# EAGLE design 1606_lora_module_Rev010003 (EAGLE 9.6.2)
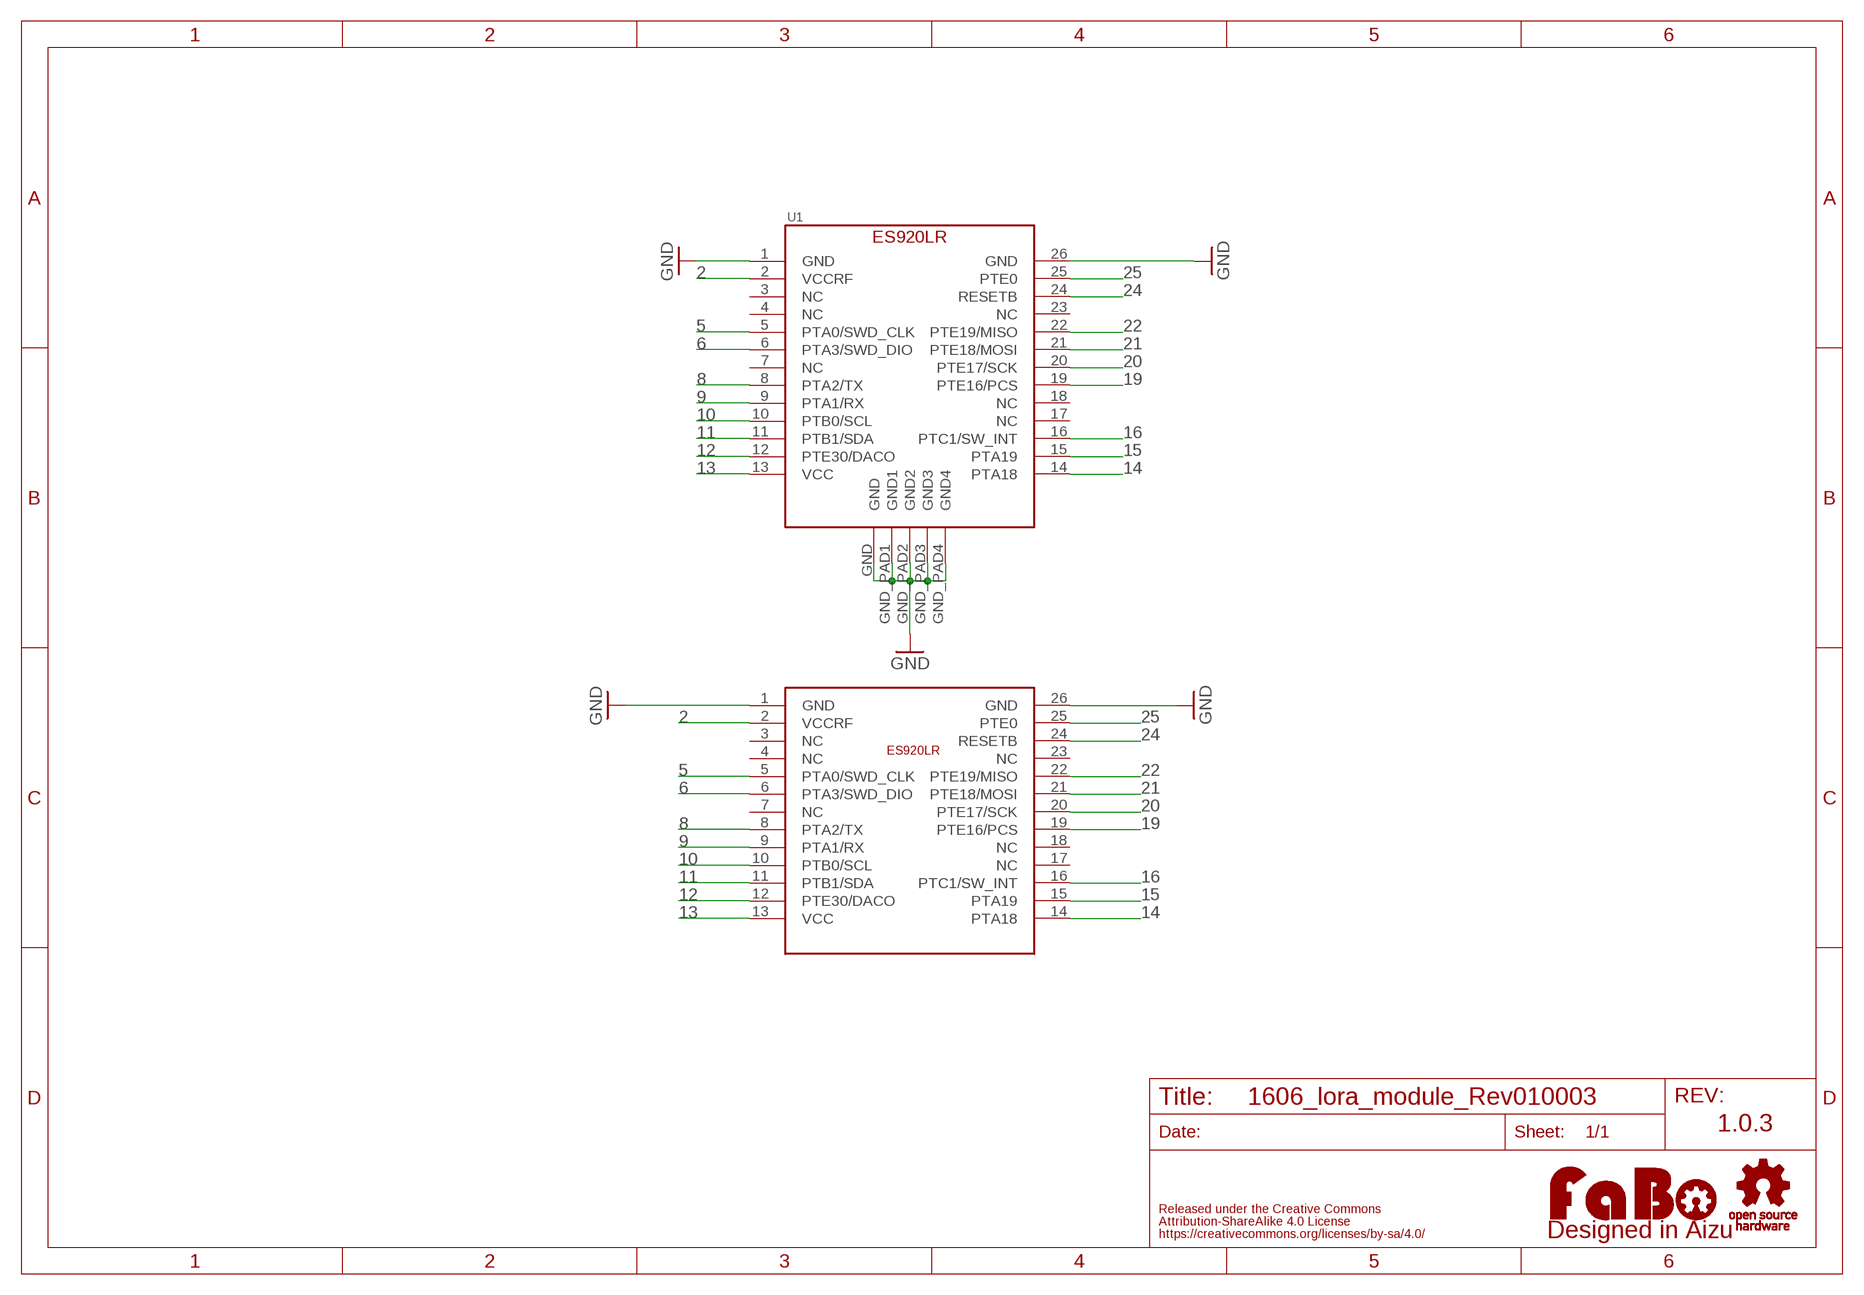
[diagram p0: schematic, sheet 1]

## Parts
U1  ES920LR  [ES920LR]
U$3  ES920LR_MODULE  [MODULE]
U$4  LOGO_OSHW-M_BOTTOM  [LOGO_OSHW_M_BOTTOM]
U$5  LOGO_FABO-M_BOTTOM  [LOGO_FABO_MS_BOTTOM]

## Nets
2: U1.2(VCCRF) U$3.2(VCCRF)
5: U1.5(PTA0/SWD_CLK) U$3.5(PTA0/SWD_CLK)
6: U1.6(PTA3/SWD_DIO) U$3.6(PTA3/SWD_DIO)
8: U1.8(PTA2/TX) U$3.8(PTA2/TX)
9: U1.9(PTA1/RX) U$3.9(PTA1/RX)
10: U1.10(PTB0/SCL) U$3.10(PTB0/SCL)
11: U1.11(PTB1/SDA) U$3.11(PTB1/SDA)
12: U1.12(PTE30/DACO) U$3.12(PTE30/DACO)
13: U1.13(VCC) U$3.13(VCC)
14: U1.14(PTA18) U$3.14(PTA18)
15: U1.15(PTA19) U$3.15(PTA19)
16: U1.16(PTC1/SW_INT) U$3.16(PTC1/SW_INT)
19: U1.19(PTE16/PCS) U$3.19(PTE16/PCS)
20: U1.20(PTE17/SCK) U$3.20(PTE17/SCK)
21: U1.21(PTE18/MOSI) U$3.21(PTE18/MOSI)
22: U1.22(PTE19/MISO) U$3.22(PTE19/MISO)
24: U1.24(RESETB) U$3.24(RESETB)
25: U1.25(PTE0) U$3.25(PTE0)
GND: U1.1(GND) U1.26(GND) U1.GND U1.GND_PAD1(GND1) U1.GND_PAD2(GND2) U1.GND_PAD3(GND3) U1.GND_PAD4(GND4) U$3.1(GND) U$3.26(GND)
Unconnected: U1.3(NC) U1.4(NC) U1.7(NC) U1.17(NC) U1.18(NC) U1.23(NC) U$3.3(NC) U$3.4(NC) U$3.7(NC) U$3.17(NC) U$3.18(NC) U$3.23(NC)

## Notes on the sheet
- 1.0.3

## Library data of the parts
U1 = FaBo-LoRa:ES920LR
U$3 = FaBo-LoRa:ES920LR_MODULE
U$4 = FaBo-Logo:LOGO_OSHW
U$5 = FaBo-Logo:LOGO_FABO

## Board
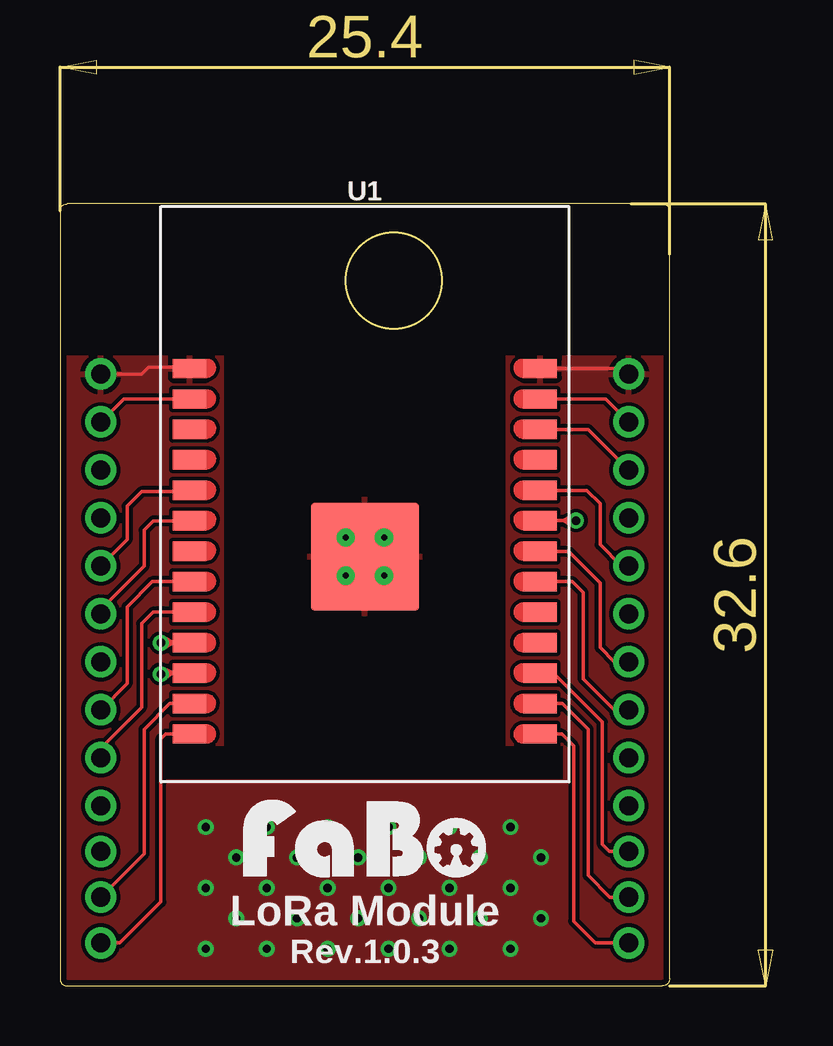
[diagram p1: board, top side]
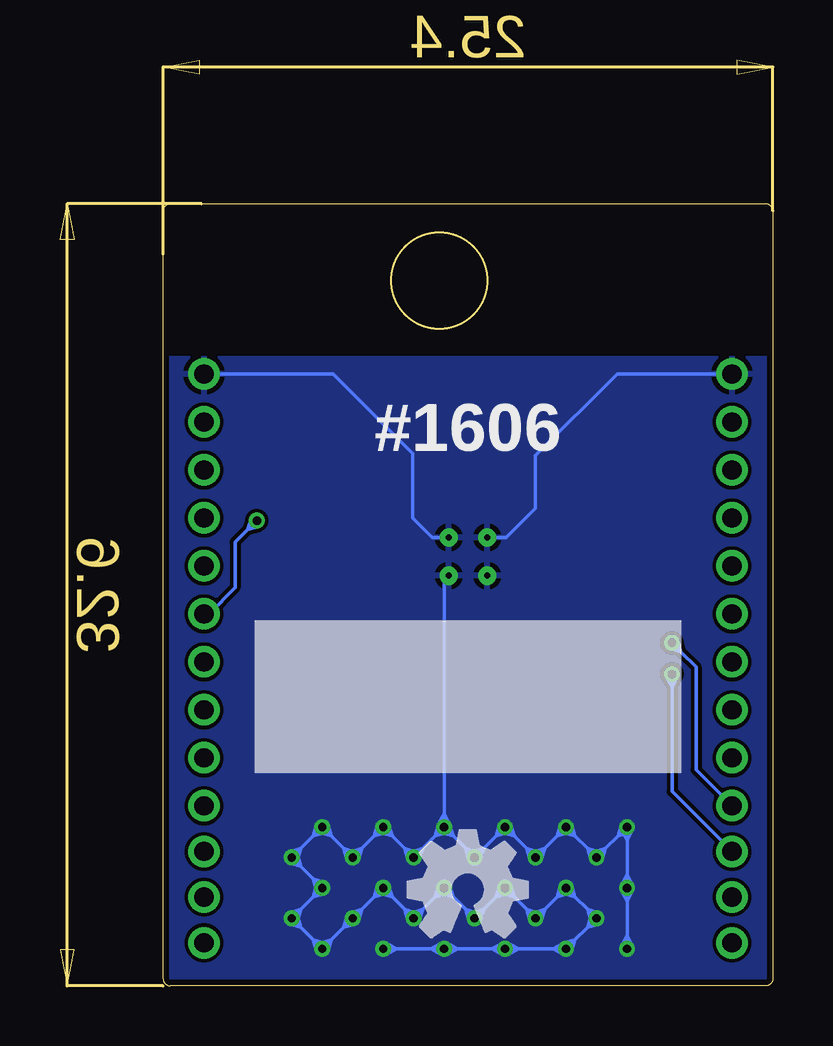
[diagram p2: board, bottom side, seen from below]

Size 25.4 x 32.6 mm. Coordinates in mm from the lower left corner, seen from the top.
Outline: 0.3,0 25.1,0 arc90 25.4,0.3 25.4,32.3 arc90 25.1,32.6 0.3,32.6 arc90 0,32.3 0,0.3 arc90 0.3,0
Copper layers (1*16): Top 0.035mm / dielectric 1.6mm / Bottom 0.035mm
Design rules "PCBway": minimum track width 6mil, minimum drill 12mil, track to track 6mil, track to pad 6mil, pad to pad 6mil, via to via 6mil, smd to smd 6mil, copper to edge 10mil, drill to drill 10mil, minimum pad ring 10mil, minimum via ring 6mil, stop-mask expansion 2mil, vias tented up to drill 100mil, thermal gap 8mil

### Footprints (pad centres in the part's own frame; a part is rotated, then mirrored left to right if it is on the bottom)
ES920LR = smd 1.4 x 0.8: 1 -7.3,5.24; 2 -7.3,3.97; 3 -7.3,2.7; 4 -7.3,1.43; 5 -7.3,0.16; 6 -7.3,-1.11; 7 -7.3,-2.38; 8 -7.3,-3.65; 9 -7.3,-4.92; 10 -7.3,-6.19; 11 -7.3,-7.46; 12 -7.3,-8.73; 13 -7.3,-10; 14 7.3,-10; 15 7.3,-8.73; 16 7.3,-7.46; 17 7.3,-6.19; 18 7.3,-4.92; 19 7.3,-3.65; 20 7.3,-2.38; 21 7.3,-1.11; 22 7.3,0.16; 23 7.3,1.43; 24 7.3,2.7; 25 7.3,3.97; 26 7.3,5.24 | smd 4.5 x 4.5: GND 0,-2.6 | drill 0.25: GND_PAD1 -0.8,-1.8; GND_PAD2 0.8,-1.8; GND_PAD3 -0.8,-3.4; GND_PAD4 0.8,-3.4
MODULE = drill 0.8 pad 1.27: 1 -11,9; 2 -11,7; 3 -11,5; 4 -11,3; 5 -11,1; 6 -11,-1; 7 -11,-3; 8 -11,-5; 9 -11,-7; 10 -11,-9; 11 -11,-10.905; 12 -11,-12.81; 13 -11,-14.715; 14 11,-14.715; 15 11,-12.81; 16 11,-10.905; 17 11,-9; 18 11,-7; 19 11,-5; 20 11,-3; 21 11,-1; 22 11,1; 23 11,3; 24 11,5; 25 11,7; 26 11,9

### Placement (x,y rotation side)
U1  12.7,20.5 0 top
U$3  12.7,16.51 0 top
U$4  12.7,4.02 0 top
U$5  12.7,4.15 0 bottom

### Tracks (layer width: path | path; a pad name or v marks a point on that pad's centre or on a via)
2
  Top 0.152: U1.2 2.66,24.47 U$3.2
5
  Top 0.152: U1.5 5.34,20.6 3.4,20.6 2.8,20 2.8,18.61 U$3.5
6
  Top 0.152: U$3.6 1.7,15.7 3.5,17.5 3.5,19 3.89,19.39 U1.6
8
  Top 0.152: U$3.8 2.8,12.6 2.8,15.8 3.85,16.85 U1.8
9
  Top 0.152: U$3.9 1.7,9.91 3.4,11.61 3.4,15.1 3.88,15.58 U1.9
10  (via drill 0.35)
  Top 0.152: U1.10 4.72,14.3 | 4.72,14.3 v4.2,14.3 | 4.72,14.3 4.32,14.52 | 4.32,14.52 | v4.2,14.3 4.32,14.52 | 4.72,14.3 4.32,14.08 | v4.2,14.3 4.32,14.08 | 4.72,14.3 4.32,14.52 | v4.2,14.3 4.32,14.52 | 4.72,14.3 4.32,14.08 | v4.2,14.3 4.32,14.08
  Bottom 0.152: v4.2,14.3 3.83,13.93 | 3.83,13.93 3.2,13.3 3.2,9.01 U$3.10 | 3.83,13.93 4.27,14.06 v4.2,14.3 | 3.83,13.93 3.96,14.37 v4.2,14.3
11  (via drill 0.35)
  Top 0.152: U1.11 4.72,13.04 | 4.72,13.04 4.24,13.04 v4.2,13 | 4.72,13.04 4.3,13.23 v4.2,13 | 4.72,13.04 4.34,12.79 v4.2,13
  Bottom 0.152: v4.2,13 4.2,12.47 | 4.2,12.47 4.2,8.11 U$3.11 | 4.2,12.47 4.42,12.88 | 4.42,12.88 | v4.2,13 4.42,12.88 | 4.2,12.47 3.98,12.88 | v4.2,13 3.98,12.88 | 4.2,12.47 4.42,12.88 | v4.2,13 4.42,12.88 | 4.2,12.47 3.98,12.88 | v4.2,13 3.98,12.88
12
  Top 0.152: U$3.12 3.5,5.5 3.5,10.7 4.57,11.77 U1.12
13
  Top 0.152: U$3.13 2.5,1.79 4.2,3.5 4.2,10.3 4.4,10.5 U1.13
14
  Top 0.152: U$3.14 22.3,1.79 21.4,2.7 21.4,10 20.9,10.5 U1.14
15
  Top 0.152: U$3.15 22.9,3.7 22,4.6 22,10.7 20.93,11.77 U1.15
16
  Top 0.152: U$3.16 22.89,5.61 22.6,5.9 22.6,11 20.56,13.04 U1.16
19
  Top 0.152: U$3.19 23.09,11.51 21.8,12.8 21.8,16.4 21.35,16.85 U1.19
20
  Top 0.152: U$3.20 23.09,13.51 22.5,14.1 22.5,16.8 21.2,18.1 20.02,18.1 U1.20
21  (via drill 0.35)
  Top 0.152: U1.21 20.98,19.4 | 20.98,19.4 v21.5,19.4 | 20.98,19.4 | 20.98,19.4 | 20.98,19.4 21.38,19.62 | 20.98,19.4 21.38,19.18 | 21.38,19.18 | v21.5,19.4 21.38,19.18 | 20.98,19.4 21.38,19.62 | v21.5,19.4 21.38,19.62 | 20.98,19.4 21.38,19.18 | v21.5,19.4 21.38,19.18 | 20.98,19.4 21.38,19.62 | v21.5,19.4 21.38,19.62
  Bottom 0.152: U$3.21 23.49,15.51 22.4,16.6 22.4,18.5 21.87,19.03 | v21.5,19.4 21.87,19.03 | 21.87,19.03 21.74,19.47 v21.5,19.4 | 21.87,19.03 21.43,19.16 v21.5,19.4
22
  Top 0.152: U1.22 21.94,20.66 22.5,20.1 22.5,18.4 23.39,17.51 U$3.22
24
  Top 0.152: U1.24 22.01,23.2 U$3.24
25
  Top 0.152: U1.25 22.74,24.47 U$3.25
GND  (via drill 0.35)
  Top 0.152: U$3.1 3.41,25.51 3.7,25.8 5.34,25.8 | U1.26 23.47,25.74 U$3.26 | U1.GND U1.GND_PAD3 | U1.GND U1.GND_PAD4 | U1.GND U1.GND_PAD2
  Bottom 0.152: U$3.1 6.49,25.51 9.9,22.1 9.9,19.9 11.1,18.7 U1.GND_PAD1 | U$3.26 18.31,25.51 15,22.2 15,19.5 14.2,18.7 U1.GND_PAD2 | v6.07,1.55 6.07,2.07 | 6.07,2.07 6.07,3.56 | 6.07,3.56 v6.07,4.09 | v6.07,4.09 6.07,4.61 | 6.07,4.61 6.07,6.1 | 6.07,6.1 v6.07,6.63 | v6.07,6.63 6.45,6.25 | 6.45,6.25 6.97,5.73 | 6.97,5.73 v7.34,5.36 | v7.34,5.36 7.71,5.73 | 7.71,5.73 8.24,6.25 | 8.24,6.25 v8.61,6.63 | v8.61,6.63 8.98,6.25 | 8.98,6.25 9.51,5.73 | 9.51,5.73 v9.88,5.36 | v9.88,5.36 10.26,5.73 | 10.26,5.73 10.78,6.25 | 10.78,6.25 v11.15,6.63 | v11.15,6.63 11.53,6.25 | 11.53,6.25 12.05,5.73 | 12.05,5.73 v12.42,5.36 | v12.42,5.36 12.79,5.73 | 12.79,5.73 13.32,6.25 | 13.32,6.25 v13.69,6.63 | v13.69,6.63 14.06,6.25 | 14.06,6.25 14.59,5.73 | 14.59,5.73 v14.96,5.36 | v14.96,5.36 15.34,5.73 | 15.34,5.73 15.86,6.25 | 15.86,6.25 v16.23,6.63 | v16.23,6.63 16.61,6.25 | 16.61,6.25 17.13,5.73 | 17.13,5.73 v17.5,5.36 | v17.5,5.36 17.88,5.73 | 17.88,5.73 18.4,6.25 | 18.4,6.25 v18.77,6.63 | v18.77,6.63 19.14,6.25 | 19.14,6.25 19.67,5.73 | 19.67,5.73 v20.04,5.36 | v20.04,5.36 19.67,4.99 | 19.67,4.99 19.14,4.46 | 19.14,4.46 v18.77,4.09 | v18.77,4.09 19.14,3.71 | 19.14,3.71 19.67,3.19 | 19.67,3.19 v20.04,2.82 | v20.04,2.82 19.67,2.44 | 19.67,2.44 19.14,1.92 | 19.14,1.92 v18.77,1.55 | v18.77,1.55 18.4,1.92 | 18.4,1.92 17.88,2.44 | 17.88,2.44 v17.5,2.82 | v17.5,2.82 17.13,3.19 | 17.13,3.19 16.61,3.71 | 16.61,3.71 v16.23,4.09 | v16.23,4.09 15.86,3.71 | 15.86,3.71 15.34,3.19 | 15.34,3.19 v14.96,2.82 | v14.96,2.82 14.59,3.19 | 14.59,3.19 14.06,3.71 | 14.06,3.71 v13.69,4.09 | v13.69,4.09 13.32,3.71 | 13.32,3.71 12.79,3.19 | 12.79,3.19 v12.42,2.82 | v12.42,2.82 12.05,3.19 | 12.05,3.19 11.53,3.71 | 11.53,3.71 v11.15,4.09
  Bottom 0.152: v11.15,4.09 10.78,3.71 | 10.78,3.71 10.26,3.19 | 10.26,3.19 v9.88,2.82 | v9.88,2.82 9.51,3.19 | 9.51,3.19 8.98,3.71 | 8.98,3.71 v8.61,4.09 | v8.61,4.09 8.24,3.71 | 8.24,3.71 7.71,3.19 | 7.71,3.19 v7.34,2.82 | v7.34,2.82 7.71,2.44 | 7.71,2.44 8.24,1.92 | 8.24,1.92 v8.61,1.55 | v8.61,1.55 9.14,1.55 | 9.14,1.55 10.63,1.55 | 10.63,1.55 v11.15,1.55 | v11.15,1.55 11.68,1.55 | 11.68,1.55 13.17,1.55 | 13.17,1.55 v13.69,1.55 | v13.69,1.55 14.22,1.55 | 14.22,1.55 15.71,1.55 | 15.71,1.55 v16.23,1.55 | U1.GND_PAD4 13.69,16.91 13.69,7.15 | 13.69,7.15 v13.69,6.63 | 6.07,6.1 6.29,6.51 | 6.29,6.51 | v6.07,6.63 6.29,6.51 | 6.07,6.1 5.85,6.51 | v6.07,6.63 5.85,6.51 | 6.07,6.1 6.29,6.51 | v6.07,6.63 6.29,6.51 | 6.07,6.1 5.85,6.51 | v6.07,6.63 5.85,6.51 | 6.45,6.25 6.31,6.7 v6.07,6.63 | 6.45,6.25 6,6.39 v6.07,6.63 | 6.97,5.73 7.1,5.29 v7.34,5.36 | 6.97,5.73 7.41,5.6 v7.34,5.36 | 7.71,5.73 7.27,5.6 v7.34,5.36 | 7.71,5.73 7.58,5.29 v7.34,5.36 | 8.24,6.25 8.68,6.39 v8.61,6.63 | 8.24,6.25 8.37,6.7 v8.61,6.63 | 8.98,6.25 8.85,6.7 v8.61,6.63 | 8.98,6.25 8.54,6.39 v8.61,6.63 | 6.07,4.61 | 6.07,4.61 | 6.07,4.61 6.29,4.21 | 6.07,3.56 6.29,3.97 | 6.29,3.97 | v6.07,4.09 6.29,3.97 | 6.07,3.56 5.85,3.97 | v6.07,4.09 5.85,3.97 | 6.07,3.56 6.29,3.97 | v6.07,4.09 6.29,3.97 | 6.07,3.56 5.85,3.97 | v6.07,4.09 5.85,3.97 | 6.07,4.61 5.85,4.21 | 5.85,4.21 | v6.07,4.09 5.85,4.21 | 6.07,4.61 6.29,4.21 | v6.07,4.09 6.29,4.21 | 6.07,4.61 5.85,4.21 | v6.07,4.09 5.85,4.21 | 6.07,4.61 6.29,4.21 | v6.07,4.09 6.29,4.21 | 8.98,3.71 8.85,4.16 v8.61,4.09 | 8.98,3.71 8.54,3.85 v8.61,4.09 | 8.24,3.71 8.68,3.85 v8.61,4.09 | 8.24,3.71 8.37,4.16 v8.61,4.09 | 7.71,3.19 7.27,3.06 v7.34,2.82 | 7.71,3.19 7.58,2.75 v7.34,2.82 | 7.71,2.44 7.58,2.89 v7.34,2.82
  Bottom 0.152: 7.71,2.44 7.27,2.58 v7.34,2.82 | 6.07,2.07 | 6.07,2.07 | 6.07,2.07 6.29,1.67 | 6.07,2.07 5.85,1.67 | 5.85,1.67 | v6.07,1.55 5.85,1.67 | 6.07,2.07 6.29,1.67 | v6.07,1.55 6.29,1.67 | 6.07,2.07 5.85,1.67 | v6.07,1.55 5.85,1.67 | 6.07,2.07 6.29,1.67 | v6.07,1.55 6.29,1.67 | 8.24,1.92 8.37,1.48 v8.61,1.55 | 8.24,1.92 8.68,1.79 v8.61,1.55 | 9.14,1.55 8.73,1.77 | 8.73,1.77 | v8.61,1.55 8.73,1.77 | 9.14,1.55 8.73,1.33 | v8.61,1.55 8.73,1.33 | 9.14,1.55 8.73,1.77 | v8.61,1.55 8.73,1.77 | 9.14,1.55 8.73,1.33 | v8.61,1.55 8.73,1.33 | 9.51,5.73 9.64,5.29 v9.88,5.36 | 9.51,5.73 9.95,5.6 v9.88,5.36 | 10.26,5.73 9.81,5.6 v9.88,5.36 | 10.26,5.73 10.12,5.29 v9.88,5.36 | 10.78,6.25 11.22,6.39 v11.15,6.63 | 10.78,6.25 10.91,6.7 v11.15,6.63 | 11.53,6.25 11.39,6.7 v11.15,6.63 | 11.53,6.25 11.08,6.39 v11.15,6.63 | 12.05,5.73 12.18,5.29 v12.42,5.36 | 12.05,5.73 12.49,5.6 v12.42,5.36 | 12.79,5.73 12.35,5.6 v12.42,5.36 | 12.79,5.73 12.66,5.29 v12.42,5.36 | 11.53,3.71 11.39,4.16 v11.15,4.09 | 11.53,3.71 11.08,3.85 v11.15,4.09 | 10.78,3.71 11.22,3.85 v11.15,4.09 | 10.78,3.71 10.91,4.16 v11.15,4.09 | 10.26,3.19 9.81,3.06 v9.88,2.82 | 10.26,3.19 10.12,2.75 v9.88,2.82 | 9.51,3.19 9.64,2.75 v9.88,2.82 | 9.51,3.19 9.95,3.06 v9.88,2.82 | 10.63,1.55 | 10.63,1.55 | 10.63,1.55 11.03,1.77 | 10.63,1.55 11.03,1.33 | 11.03,1.33 | v11.15,1.55 11.03,1.33 | 10.63,1.55 11.03,1.77 | v11.15,1.55 11.03,1.77 | 10.63,1.55 11.03,1.33 | v11.15,1.55 11.03,1.33 | 10.63,1.55 11.03,1.77 | v11.15,1.55 11.03,1.77 | 11.68,1.55 11.27,1.77 | 11.27,1.77 | v11.15,1.55 11.27,1.77 | 11.68,1.55 11.27,1.33 | v11.15,1.55 11.27,1.33 | 11.68,1.55 11.27,1.77 | v11.15,1.55 11.27,1.77 | 11.68,1.55 11.27,1.33 | v11.15,1.55 11.27,1.33 | 12.79,3.19 12.35,3.06 v12.42,2.82
  Bottom 0.152: 12.79,3.19 12.66,2.75 v12.42,2.82 | 12.05,3.19 12.18,2.75 v12.42,2.82 | 12.05,3.19 12.49,3.06 v12.42,2.82 | 13.69,7.15 | 13.69,7.15 | 13.69,7.15 13.91,6.75 | 13.32,6.25 13.76,6.39 v13.69,6.63 | 13.32,6.25 13.45,6.7 v13.69,6.63 | 14.06,6.25 13.93,6.7 v13.69,6.63 | 14.06,6.25 13.62,6.39 v13.69,6.63 | 13.69,7.15 13.47,6.75 | 13.47,6.75 | v13.69,6.63 13.47,6.75 | 13.69,7.15 13.91,6.75 | v13.69,6.63 13.91,6.75 | 13.69,7.15 13.47,6.75 | v13.69,6.63 13.47,6.75 | 13.69,7.15 13.91,6.75 | v13.69,6.63 13.91,6.75 | 14.59,5.73 14.72,5.29 v14.96,5.36 | 14.59,5.73 15.03,5.6 v14.96,5.36 | 15.34,5.73 14.89,5.6 v14.96,5.36 | 15.34,5.73 15.2,5.29 v14.96,5.36 | 14.06,3.71 13.93,4.16 v13.69,4.09 | 14.06,3.71 13.62,3.85 v13.69,4.09 | 13.32,3.71 13.76,3.85 v13.69,4.09 | 13.32,3.71 13.45,4.16 v13.69,4.09 | 15.86,6.25 16.3,6.39 v16.23,6.63 | 15.86,6.25 15.99,6.7 v16.23,6.63 | 16.61,6.25 16.47,6.7 v16.23,6.63 | 16.61,6.25 16.16,6.39 v16.23,6.63 | 17.13,5.73 17.26,5.29 v17.5,5.36 | 17.13,5.73 17.57,5.6 v17.5,5.36 | 17.88,5.73 17.43,5.6 v17.5,5.36 | 17.88,5.73 17.74,5.29 v17.5,5.36 | 18.4,6.25 18.84,6.39 v18.77,6.63 | 18.4,6.25 18.53,6.7 v18.77,6.63 | 19.14,6.25 19.01,6.7 v18.77,6.63 | 19.14,6.25 18.7,6.39 v18.77,6.63 | 19.67,5.73 19.8,5.29 v20.04,5.36 | 19.67,5.73 20.11,5.6 v20.04,5.36 | 19.67,4.99 20.11,5.12 v20.04,5.36 | 19.67,4.99 19.8,5.43 v20.04,5.36 | 16.61,3.71 16.47,4.16 v16.23,4.09 | 16.61,3.71 16.16,3.85 v16.23,4.09 | 15.86,3.71 16.3,3.85 v16.23,4.09 | 15.86,3.71 15.99,4.16 v16.23,4.09 | 19.14,4.46 18.7,4.33 v18.77,4.09 | 19.14,4.46 19.01,4.02 v18.77,4.09 | 19.14,3.71 19.01,4.16 v18.77,4.09 | 19.14,3.71 18.7,3.85 v18.77,4.09 | 15.34,3.19 14.89,3.06 v14.96,2.82
  Bottom 0.152: 15.34,3.19 15.2,2.75 v14.96,2.82 | 14.59,3.19 14.72,2.75 v14.96,2.82 | 14.59,3.19 15.03,3.06 v14.96,2.82 | 17.88,2.44 17.74,2.89 v17.5,2.82 | 17.88,2.44 17.43,2.58 v17.5,2.82 | 17.13,3.19 17.26,2.75 v17.5,2.82 | 17.13,3.19 17.57,3.06 v17.5,2.82 | 19.67,3.19 19.8,2.75 v20.04,2.82 | 19.67,3.19 20.11,3.06 v20.04,2.82 | 19.67,2.44 20.11,2.58 v20.04,2.82 | 19.67,2.44 19.8,2.89 v20.04,2.82 | 19.14,1.92 18.7,1.79 v18.77,1.55 | 19.14,1.92 19.01,1.48 v18.77,1.55 | 18.4,1.92 18.53,1.48 v18.77,1.55 | 18.4,1.92 18.84,1.79 v18.77,1.55 | 15.71,1.55 | 15.71,1.55 | 15.71,1.55 16.11,1.77 | 15.71,1.55 16.11,1.33 | 16.11,1.33 | v16.23,1.55 16.11,1.33 | 15.71,1.55 16.11,1.77 | v16.23,1.55 16.11,1.77 | 15.71,1.55 16.11,1.33 | v16.23,1.55 16.11,1.33 | 15.71,1.55 16.11,1.77 | v16.23,1.55 16.11,1.77 | 13.17,1.55 | 13.17,1.55 | 13.17,1.55 13.57,1.77 | 13.17,1.55 13.57,1.33 | 13.57,1.33 | v13.69,1.55 13.57,1.33 | 13.17,1.55 13.57,1.77 | v13.69,1.55 13.57,1.77 | 13.17,1.55 13.57,1.33 | v13.69,1.55 13.57,1.33 | 13.17,1.55 13.57,1.77 | v13.69,1.55 13.57,1.77 | 14.22,1.55 13.81,1.77 | 13.81,1.77 | v13.69,1.55 13.81,1.77 | 14.22,1.55 13.81,1.33 | v13.69,1.55 13.81,1.33 | 14.22,1.55 13.81,1.77 | v13.69,1.55 13.81,1.77 | 14.22,1.55 13.81,1.33 | v13.69,1.55 13.81,1.33
  pour Top: 0,0 25.4,0 25.4,26.21 0,26.21
  pour Bottom: -0.8,26.2 25.7,26.2 25.7,-0.5 -0.8,-0.5

### Text on the board
tPlace: LoRa Module | Rev.1.0.3
bPlace: #1606
Document: #1606 LORA MODULE Rev1.0.3 / 2022/08/17